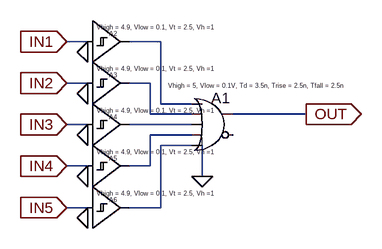
[diagram p0: schematic SN74LVC1G332DBVR.asc]
SN74LVC1G332DBVR.asc, the LTspice schematic file:
Version 4.1
SHEET 1 880 680
WIRE 0 80 -32 80
WIRE 112 80 64 80
WIRE 0 144 -32 144
WIRE 96 144 64 144
WIRE 112 176 112 80
WIRE 160 176 112 176
WIRE 96 192 96 144
WIRE 160 192 96 192
WIRE 336 192 224 192
WIRE 0 208 -32 208
WIRE 160 208 64 208
WIRE 160 224 96 224
WIRE 160 240 112 240
WIRE 0 272 -32 272
WIRE 96 272 96 224
WIRE 96 272 64 272
WIRE 176 288 176 240
WIRE 0 336 -32 336
WIRE 112 336 112 240
WIRE 112 336 64 336
FLAG 176 288 0
FLAG 0 224 0
FLAG 0 160 0
FLAG 0 96 0
FLAG 0 352 0
FLAG 0 288 0
FLAG -32 80 IN1
IOPIN -32 80 In
FLAG -32 144 IN2
IOPIN -32 144 In
FLAG -32 208 IN3
IOPIN -32 208 In
FLAG -32 272 IN4
IOPIN -32 272 In
FLAG -32 336 IN5
IOPIN -32 336 In
FLAG 336 192 OUT
IOPIN 336 192 Out
SYMBOL Digital\\or 192 144 R0
WINDOW 0 -2 23 Left 2
WINDOW 3 -68 4 Left 0
SYMATTR InstName A1
SYMATTR Value Vhigh = 5, Vlow = 0.1V, Td = 3.5n, Trise = 2.5n, Tfall = 2.5n
SYMBOL Digital\\schmtbuf 0 16 R0
WINDOW 0 33 52 Left 0
WINDOW 3 14 42 Left 0
SYMATTR InstName A2
SYMATTR Value Vhigh = 4.9, Vlow = 0.1, Vt = 2.5, Vh =1
SYMBOL Digital\\schmtbuf 0 80 R0
WINDOW 0 33 52 Left 0
WINDOW 3 14 42 Left 0
SYMATTR InstName A3
SYMATTR Value Vhigh = 4.9, Vlow = 0.1, Vt = 2.5, Vh =1
SYMBOL Digital\\schmtbuf 0 144 R0
WINDOW 0 33 52 Left 0
WINDOW 3 14 42 Left 0
SYMATTR InstName A4
SYMATTR Value Vhigh = 4.9, Vlow = 0.1, Vt = 2.5, Vh =1
SYMBOL Digital\\schmtbuf 0 208 R0
WINDOW 0 33 52 Left 0
WINDOW 3 14 42 Left 0
SYMATTR InstName A5
SYMATTR Value Vhigh = 4.9, Vlow = 0.1, Vt = 2.5, Vh =1
SYMBOL Digital\\schmtbuf 0 272 R0
WINDOW 0 33 52 Left 0
WINDOW 3 14 42 Left 0
SYMATTR InstName A6
SYMATTR Value Vhigh = 4.9, Vlow = 0.1, Vt = 2.5, Vh =1

The netlist it stands for:
* SN74LVC1G332DBVR.asc
A1 N001 N002 N003 N004 N005 0 OUT 0 OR Vhigh = 5, Vlow = 0.1V, Td = 3.5n, Trise = 2.5n, Tfall = 2.5n
A2 IN1 0 0 0 0 0 N001 0 SCHMITT Vhigh = 4.9, Vlow = 0.1, Vt = 2.5, Vh =1
A3 IN2 0 0 0 0 0 N002 0 SCHMITT Vhigh = 4.9, Vlow = 0.1, Vt = 2.5, Vh =1
A4 IN3 0 0 0 0 0 N003 0 SCHMITT Vhigh = 4.9, Vlow = 0.1, Vt = 2.5, Vh =1
A5 IN4 0 0 0 0 0 N004 0 SCHMITT Vhigh = 4.9, Vlow = 0.1, Vt = 2.5, Vh =1
A6 IN5 0 0 0 0 0 N005 0 SCHMITT Vhigh = 4.9, Vlow = 0.1, Vt = 2.5, Vh =1
.backanno
.end